# Altium schematic sheet 10uF 10V SCH.schdoc
size 44 x 29 mm
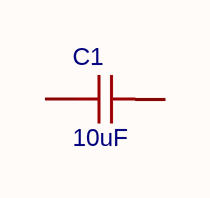
[diagram p0: 10uF 10V SCH.schdoc]

## Parts
C1  10uF  [C0402]

## Nets

Not connected (* = marked no-connect by the designer): C1 1 2

## Library data of the parts
C1 = 10uF: CAP CER 10UF 10V X5R 0402; Manufacturer: muRata(村田); Manufacturer Part: GRM155R61A106ME11D; nameAlias: Value; Contributor: LCSC; Supplier: LCSC; Supplier Part: C408132; JLCPCB Part Class: Extended Part; spicePre: C; spiceSymbolName: GRM155R61A106ME11D; LCSC Part Number: C408132